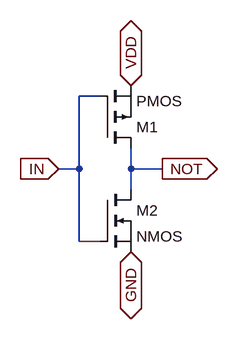
[diagram p0: schematic not.asc]
not.asc, the LTspice schematic file:
Version 4
SHEET 1 880 680
WIRE 128 48 96 48
WIRE 176 64 176 32
WIRE 96 160 96 48
WIRE 96 160 64 160
WIRE 176 160 176 128
WIRE 224 160 176 160
WIRE 176 192 176 160
WIRE 96 272 96 160
WIRE 128 272 96 272
WIRE 176 288 176 256
FLAG 176 32 VDD
IOPIN 176 32 BiDir
FLAG 64 160 IN
IOPIN 64 160 In
FLAG 224 160 NOT
IOPIN 224 160 Out
FLAG 176 288 GND
IOPIN 176 288 BiDir
SYMBOL pmos 128 128 M180
SYMATTR InstName M1
SYMBOL nmos 128 192 R0
SYMATTR InstName M2

The netlist it stands for:
* not.asc
M1 NOT IN VDD VDD PMOS
M2 NOT IN GND GND NMOS
.model NMOS NMOS
.model PMOS PMOS
.lib standard.mos
.backanno
.end